# Altium schematic sheet mcu.SchDoc
size A4
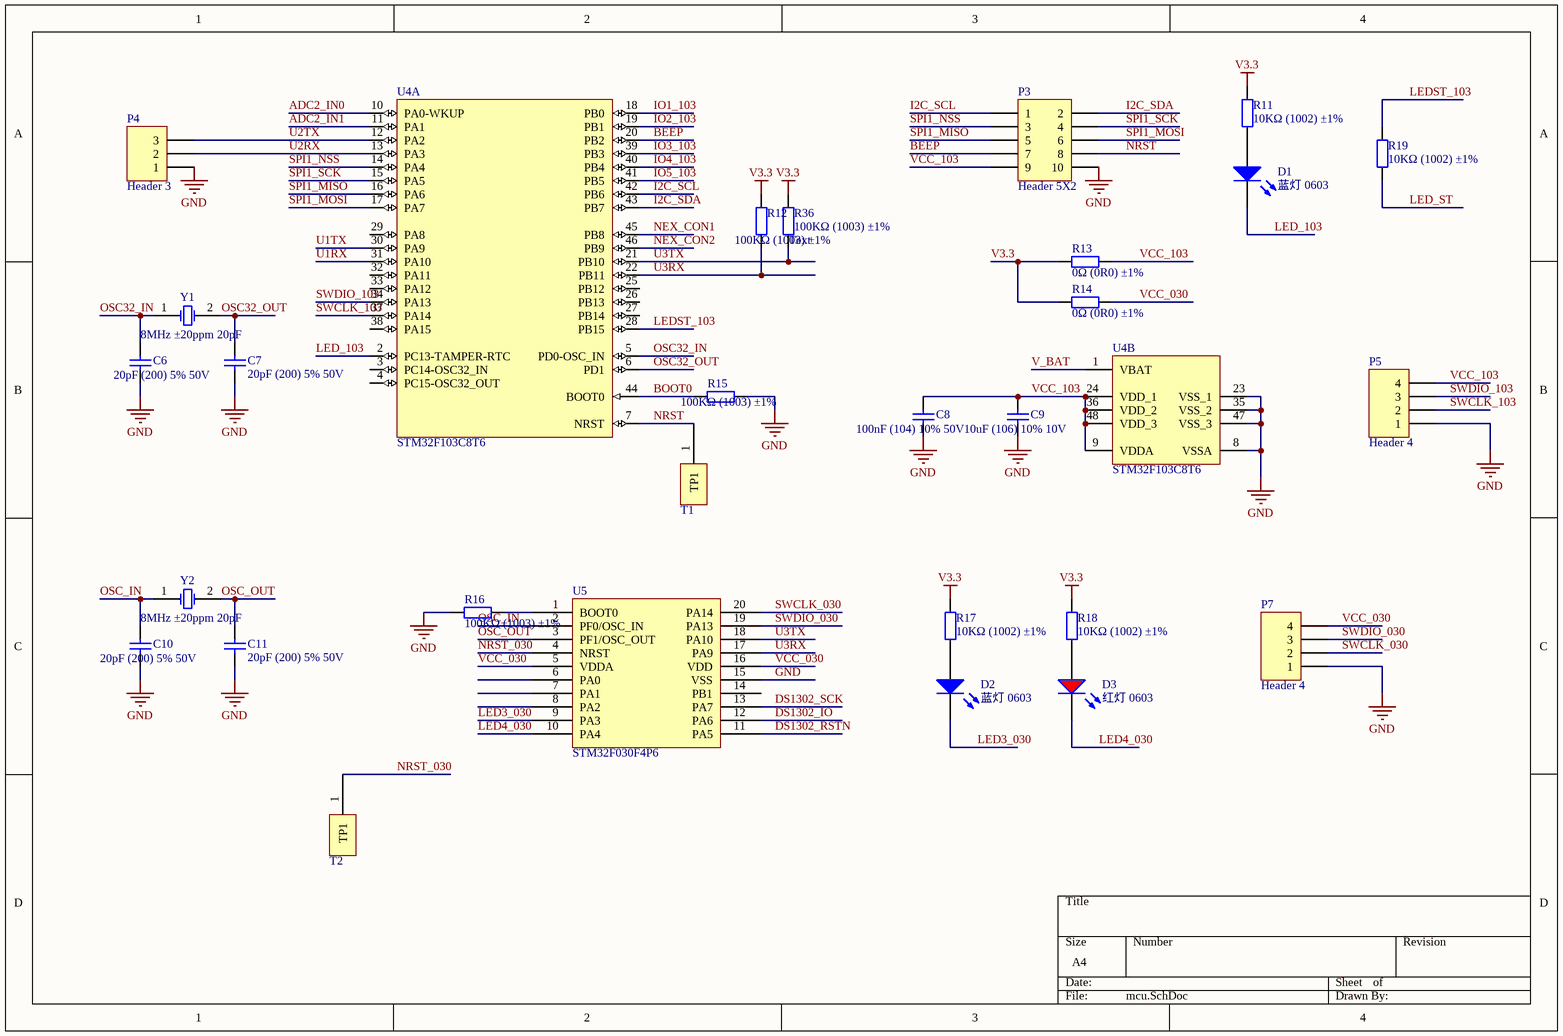
[diagram p0: mcu.SchDoc]

## Parts
C6  20pF (200) 5% 50V  [0603_C]
C7  20pF (200) 5% 50V  [0603_C]
C8  100nF (104) 10% 50V  [0603_C]
C9  10uF (106) 10% 10V  [0603_C]
C10  20pF (200) 5% 50V  [0603_C]
C11  20pF (200) 5% 50V  [0603_C]
D1  蓝灯 0603  [0603_LED_S1]
D2  蓝灯 0603  [0603_LED_S1]
D3  红灯 0603  [0603_LED_S1]
P3  Header 5X2  [HDR2X5]
P4  Header 3  [HDR1X3]
P5  Header 4  [HDR1X4]
P7  Header 4  [HDR1X4]
R11  10KΩ (1002) ±1%  [0603_R]
R12  100KΩ (1003) ±1%  [0603_R]
R13  0Ω (0R0) ±1%  [1206_R]
R14  0Ω (0R0) ±1%  [1206_R]
R15  100KΩ (1003) ±1%  [0603_R]
R16  100KΩ (1003) ±1%  [0603_R]
R17  10KΩ (1002) ±1%  [0603_R]
R18  10KΩ (1002) ±1%  [0603_R]
R19  10KΩ (1002) ±1%  [0603_R]
R36  100KΩ (1003) ±1%  [0603_R]
T1  TP1  [TP1]  (value not drawn)
T2  TP1  [TP1]  (value not drawn)
U4  STM32F103C8T6  [LQFP-48_7x7x05P]  (parts A,B of 2)
U5  STM32F030F4P6  [TSSOP-20]
Y1  8MHz ±20ppm 20pF  [SMD-5032_2P]
Y2  8MHz ±20ppm 20pF  [SMD-5032_2P]

## Nets
GND: C6.1 C7.1 C8.1 C9.2 C10.1 C11.1 P3.10 P4.1 P5.1 P7.1 R15.2 R16.1 U4.8(VSSA) U4.23(VSS_1) U4.35(VSS_2) U4.47(VSS_3) U5.15(VSS)
V3.3: R11.2 R12.2 R13.1 R14.1 R17.2 R18.2 R36.2
ADC2_IN0: U4.10(PA0-WKUP)
ADC2_IN1: U4.11(PA1)
BEEP: P3.7 U4.20(PB2)
BOOT0: R15.1 U4.44(BOOT0)
DS1302_IO: U5.12(PA6)
DS1302_RSTN: U5.11(PA5)
DS1302_SCK: U5.13(PA7)
I2C_SCL: P3.1 U4.42(PB6)
I2C_SDA: P3.2 U4.43(PB7)
IO1_103: U4.18(PB0)
IO2_103: U4.19(PB1)
IO3_103: U4.39(PB3)
IO4_103: U4.40(PB4)
IO5_103: U4.41(PB5)
LED3_030: D2.K U5.9(PA3)
LED4_030: D3.K U5.10(PA4)
LED_103: D1.K U4.2(PC13-TAMPER-RTC)
LED_ST: R19.1
LEDST_103: R19.2 U4.28(PB15)
NEX_CON1: U4.45(PB8)
NEX_CON2: U4.46(PB9)
NRST: P3.8 T1.1(TP1) U4.7(NRST)
NRST_030: T2.1(TP1) U5.4(NRST)
OSC32_IN: C6.2 U4.5(PD0-OSC_IN) Y1.1(OSC1)
OSC32_OUT: C7.2 U4.6(PD1) Y1.2(OSC2)
OSC_IN: C10.2 U5.2(PF0/OSC_IN) Y2.1(OSC1)
OSC_OUT: C11.2 U5.3(PF1/OSC_OUT) Y2.2(OSC2)
SPI1_MISO: P3.5 U4.16(PA6)
SPI1_MOSI: P3.6 U4.17(PA7)
SPI1_NSS: P3.3 U4.14(PA4)
SPI1_SCK: P3.4 U4.15(PA5)
SWCLK_030: P7.2 U5.20(PA14)
SWCLK_103: P5.2 U4.37(PA14)
SWDIO_030: P7.3 U5.19(PA13)
SWDIO_103: P5.3 U4.34(PA13)
U1RX: U4.31(PA10)
U1TX: U4.30(PA9)
U2RX: P4.2 U4.13(PA3)
U2TX: P4.3 U4.12(PA2)
U3RX: R12.1 U4.22(PB11) U5.17(PA9)
U3TX: R36.1 U4.21(PB10) U5.18(PA10)
V_BAT: U4.1(VBAT)
VCC_030: P7.4 R14.2 U5.5(VDDA) U5.16(VDD)
VCC_103: C8.2 C9.1 P3.9 P5.4 R13.2 U4.9(VDDA) U4.24(VDD_1) U4.36(VDD_2) U4.48(VDD_3)
NetD1_A: D1.A R11.1
NetD2_A: D2.A R17.1
NetD3_A: D3.A R18.1
NetR16_2: R16.2 U5.1(BOOT0)

Not connected (* = marked no-connect by the designer): U4 3(PC14-OSC32_IN) 4(PC15-OSC32_OUT) 25(PB12) 26(PB13) 27(PB14) 29(PA8) 32(PA11) 33(PA12) 38(PA15); U5 6(PA0) 7(PA1) 8(PA2) 14(PB1)

## Notes on the sheet
- (near R36) Text

## Library data of the parts
C6 C7 C10 C11 = 0603 20pF (200) 5% 50V: 贴片电容; ComponentLink1Description: 供应商链接; ComponentLink1URL: http://www.szlcsc.com/product/details_2000.html; Package: 0603; Supplier: LC; SuppliersPartNumber: C1648
C8 = 0603 100nF (104) 10% 50V: 贴片电容; ComponentLink1Description: 供应商链接; ComponentLink1URL: http://www.szlcsc.com/product/details_15331.html; Package: 0603; Supplier: LC; SuppliersPartNumber: C14663
C9 = 0603 10uF (106) 10% 10V: 贴片电容; ComponentLink1Description: 供应商链接; ComponentLink1URL: http://www.szlcsc.com/product/details_20411.html; Package: 0603; Supplier: LC; SuppliersPartNumber: C19702
D1 D2 = 0603 蓝灯: 发光二极管; ComponentLink1Description: 供应商链接; ComponentLink1URL: http://www.szlcsc.com/product/details_73150.html; Package: 0603; Supplier: LC; SuppliersPartNumber: C72041
D3 = 0603 红灯: 发光二极管; ComponentLink1Description: 供应商链接; ComponentLink1URL: http://www.szlcsc.com/product/details_2659.html; Package: 0603; Supplier: LC; SuppliersPartNumber: C2286
P3 = Header 5X2: Header, 5-Pin, Dual row; LatestRevisionDate: 17-Jul-2002; LatestRevisionNote: Re-released for DXP Platform.; Publisher: Altium Limited
P4 = Header 3: Header, 3-Pin; LatestRevisionDate: 17-Jul-2002; LatestRevisionNote: Re-released for DXP Platform.; Publisher: Altium Limited
P5 P7 = Header 4: Header, 4-Pin; LatestRevisionDate: 17-Jul-2002; LatestRevisionNote: Re-released for DXP Platform.; Publisher: Altium Limited
R11 R17-R19 = 0603 10KΩ (1002) 1%: 贴片电阻; ComponentLink1Description: 供应商链接; ComponentLink1URL: http://www.szlcsc.com/product/details_26547.html; Package: 0603; Supplier: LC; SuppliersPartNumber: C25804
R12 R15 R16 R36 = 0603 100KΩ (1003) 1%: 贴片电阻; ComponentLink1Description: 供应商链接; ComponentLink1URL: http://www.szlcsc.com/product/details_26546.html; Package: 0603; Supplier: LC; SuppliersPartNumber: C25803
R13 R14 = 1206 0Ω (0R0) 1%: 贴片电阻; ComponentLink1Description: 供应商链接; ComponentLink1URL: http://www.szlcsc.com/product/details_18576.html; Package: 1206; Supplier: LC; SuppliersPartNumber: C17888
U4 = STM32F103C8T6: ARM; ComponentLink1Description: 供应商链接; ComponentLink1URL: http://www.szlcsc.com/product/details_9243.html; Package: LQFP-48_7x7x05P; Supplier: LC; SuppliersPartNumber: C8734
U5 = STM32F030F4P6: ARM; ComponentLink1Description: 供应商链接; ComponentLink1URL: http://www.szlcsc.com/product/details_33873.html; Package: TSSOP-20; Supplier: LC; SuppliersPartNumber: C32908
Y1 Y2 = SMD-5032_2P 8MHz 20ppm 20pF: 贴片晶振; ComponentLink1Description: 供应商链接; ComponentLink1URL: http://www.szlcsc.com/product/details_117214.html; Package: SMD-5032_2P; Supplier: LC; SuppliersPartNumber: C115962